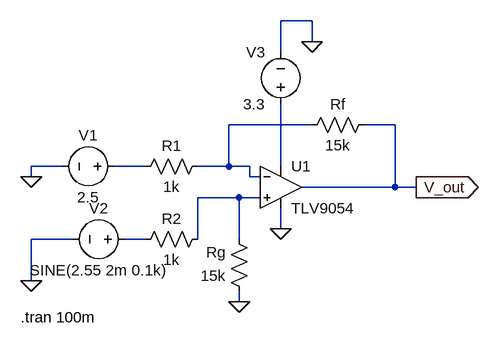
[diagram p0: schematic Differential_Amplifier.asc]
Differential_Amplifier.asc, the LTspice schematic file:
Version 4
SHEET 1 880 680
WIRE 288 -80 240 -80
WIRE 288 -48 288 -80
WIRE 240 -32 240 -80
WIRE 288 80 160 80
WIRE 416 80 368 80
WIRE -96 144 -144 144
WIRE 32 144 -16 144
WIRE 160 144 160 80
WIRE 160 144 112 144
WIRE 192 144 160 144
WIRE 240 144 240 48
WIRE -144 160 -144 144
WIRE 192 160 192 144
WIRE 208 160 192 160
WIRE 416 176 416 80
WIRE 416 176 272 176
WIRE 448 176 416 176
WIRE 176 192 112 192
WIRE 208 192 176 192
WIRE 240 240 240 208
WIRE -80 256 -144 256
WIRE 32 256 0 256
WIRE 112 256 112 192
WIRE 176 256 176 192
WIRE -144 320 -144 256
WIRE 176 352 176 336
FLAG 448 176 V_out
IOPIN 448 176 Out
FLAG 176 352 0
FLAG -144 160 0
FLAG -144 320 0
FLAG 288 -48 0
FLAG 240 240 0
SYMBOL TLV9054 240 176 R0
SYMATTR InstName U1
SYMBOL res 384 64 R90
WINDOW 0 0 56 VBottom 2
WINDOW 3 32 56 VTop 2
SYMATTR InstName Rf
SYMATTR Value 15k
SYMBOL res 128 128 R90
WINDOW 0 0 56 VBottom 2
WINDOW 3 32 56 VTop 2
SYMATTR InstName R1
SYMATTR Value 1k
SYMBOL res 192 352 R180
WINDOW 0 36 76 Left 2
WINDOW 3 36 40 Left 2
SYMATTR InstName Rg
SYMATTR Value 15k
SYMBOL voltage 0 144 R90
WINDOW 0 -32 56 VBottom 2
WINDOW 3 32 56 VTop 2
WINDOW 123 0 0 Left 0
WINDOW 39 0 0 Left 0
SYMATTR InstName V1
SYMATTR Value 2.5
SYMBOL res 128 240 R90
WINDOW 0 0 56 VBottom 2
WINDOW 3 32 56 VTop 2
SYMATTR InstName R2
SYMATTR Value 1k
SYMBOL voltage 16 256 R90
WINDOW 0 -32 56 VBottom 2
WINDOW 3 32 56 VTop 2
WINDOW 123 0 0 Left 0
WINDOW 39 0 0 Left 0
SYMATTR InstName V2
SYMATTR Value SINE(2.55 2m 0.1k)
SYMBOL voltage 240 64 R180
WINDOW 0 24 96 Left 2
WINDOW 3 24 16 Left 2
WINDOW 123 0 0 Left 0
WINDOW 39 0 0 Left 0
SYMATTR InstName V3
SYMATTR Value 3.3
TEXT -160 376 Left 2 !.tran 100m

The netlist it stands for:
* Differential_Amplifier.asc
* U1: TLV9054 (symbol TLV9054 not available, pins judged from their places): In+=N004 In-=N001 V+=N003 V-=0 OUT=V_out
Rf V_out N001 15k
R1 N001 N002 1k
Rg 0 N004 15k
V1 N002 0 2.5
R2 N004 N005 1k
V2 N005 0 SINE(2.55 2m 0.1k)
V3 N003 0 3.3
.tran 100m
.backanno
.end